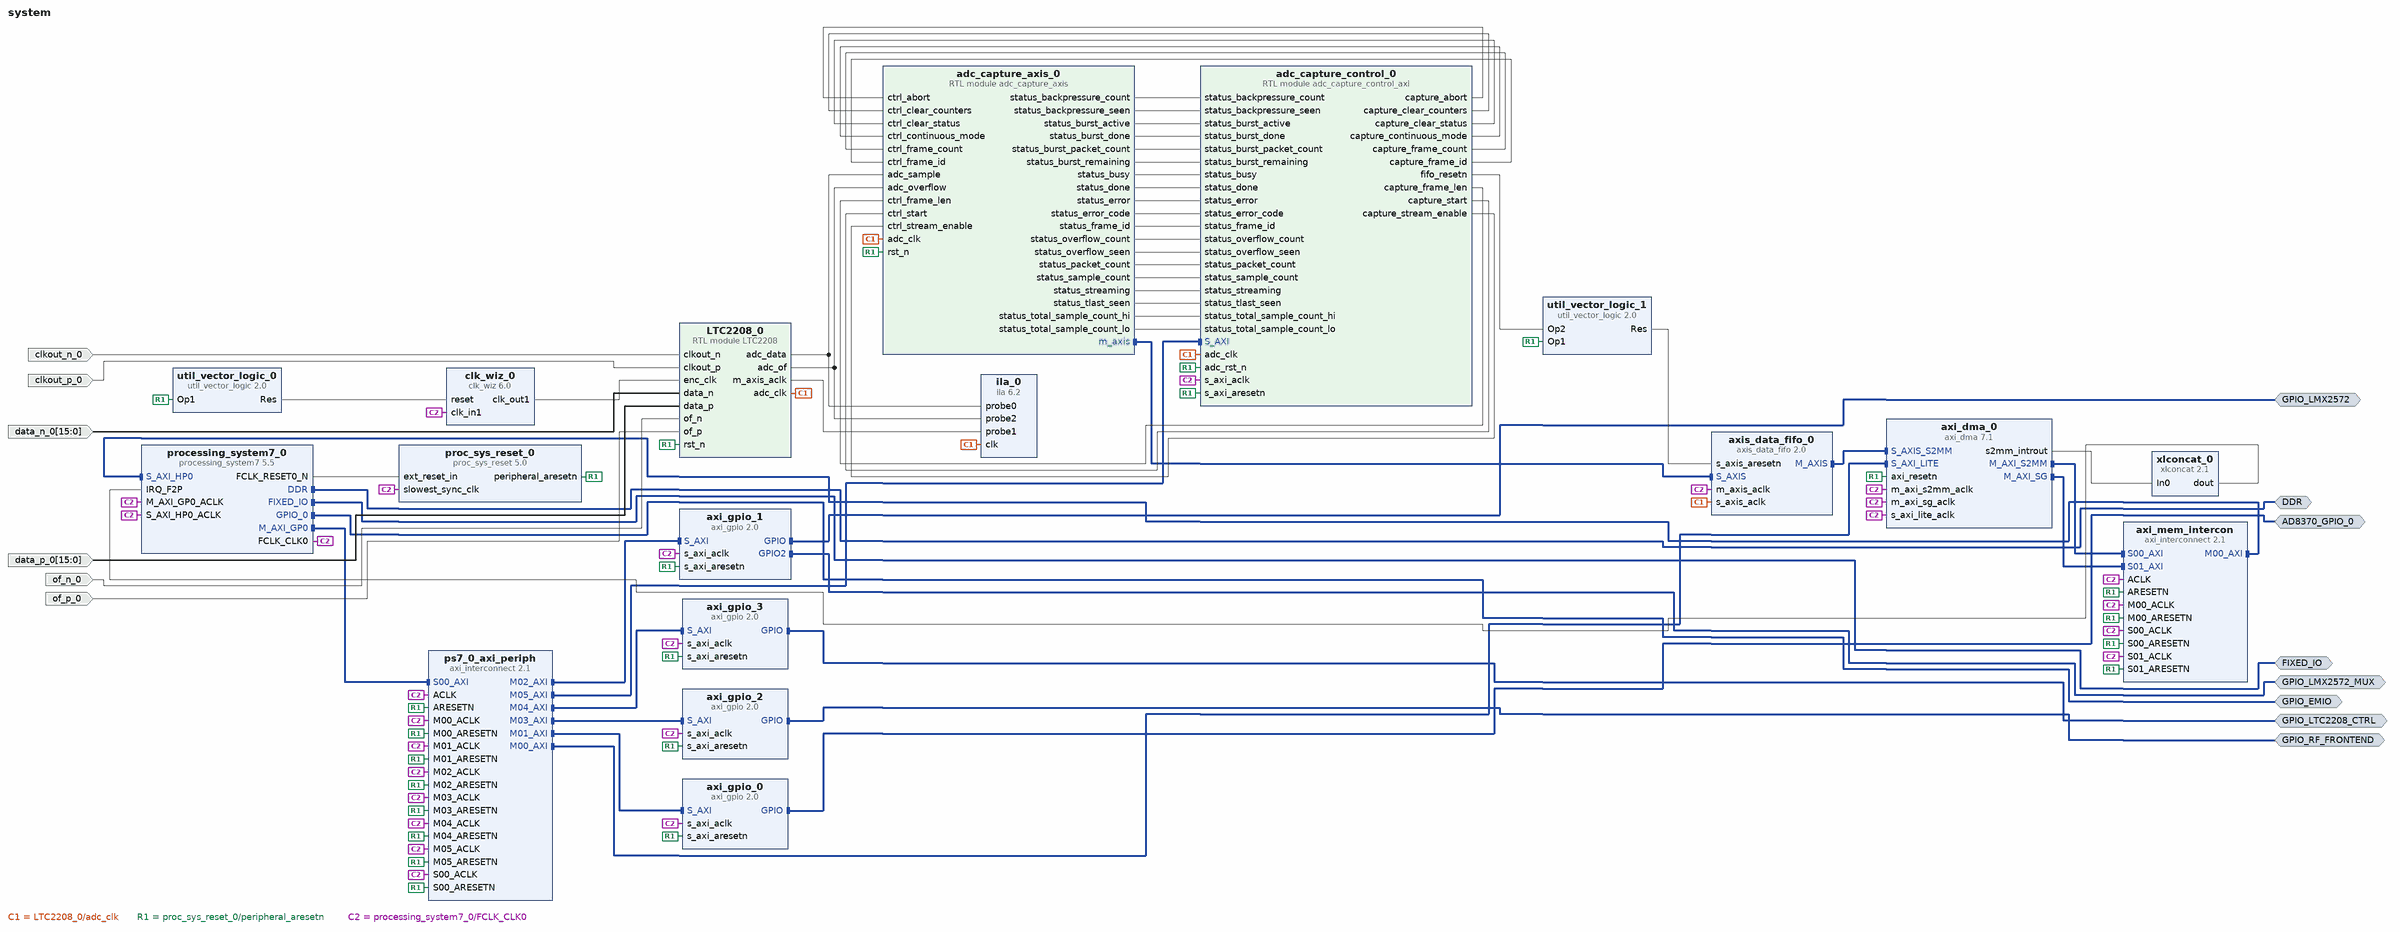
[diagram p0: block diagram of the top level]
# Vivado block design system, xc7z010clg400-1, Vivado 2021.1
create_bd_design system

create_bd_intf_port -mode Master -vlnv xilinx.com:interface:ddrx_rtl:1.0 DDR
create_bd_intf_port -mode Master -vlnv xilinx.com:display_processing_system7:fixedio_rtl:1.0 FIXED_IO
create_bd_intf_port -mode Master -vlnv xilinx.com:interface:gpio_rtl:1.0 GPIO_EMIO
create_bd_intf_port -mode Master -vlnv xilinx.com:interface:gpio_rtl:1.0 AD8370_GPIO_0
create_bd_intf_port -mode Master -vlnv xilinx.com:interface:gpio_rtl:1.0 GPIO_LMX2572
create_bd_intf_port -mode Master -vlnv xilinx.com:interface:gpio_rtl:1.0 GPIO_LMX2572_MUX
create_bd_intf_port -mode Master -vlnv xilinx.com:interface:gpio_rtl:1.0 GPIO_RF_FRONTEND
create_bd_intf_port -mode Master -vlnv xilinx.com:interface:gpio_rtl:1.0 GPIO_LTC2208_CTRL
create_bd_port -dir I clkout_p_0
create_bd_port -dir I clkout_n_0
create_bd_port -dir I -from 15 -to 0 data_p_0
create_bd_port -dir I -from 15 -to 0 data_n_0
create_bd_port -dir I of_p_0
create_bd_port -dir I of_n_0

create_bd_cell -type ip -vlnv xilinx.com:ip:processing_system7:5.5 processing_system7_0
set_property -dict [list \
  CONFIG.PCW_EN_CLK1_PORT 1 \
  CONFIG.PCW_FCLK_CLK0_BUF FALSE \
  CONFIG.PCW_FCLK_CLK1_BUF TRUE \
  CONFIG.PCW_FPGA0_PERIPHERAL_FREQMHZ 150 \
  CONFIG.PCW_FPGA1_PERIPHERAL_FREQMHZ 150 \
  CONFIG.PCW_FPGA_FCLK1_ENABLE 1 \
  CONFIG.PCW_GPIO_EMIO_GPIO_ENABLE 1 \
  CONFIG.PCW_GPIO_EMIO_GPIO_IO 4 \
  CONFIG.PCW_GPIO_EMIO_GPIO_WIDTH 4 \
  CONFIG.PCW_IRQ_F2P_INTR 1 \
  CONFIG.PCW_PRESET_BANK1_VOLTAGE {LVCMOS 1.8V} \
  CONFIG.PCW_QSPI_GRP_SINGLE_SS_ENABLE 1 \
  CONFIG.PCW_QSPI_GRP_SINGLE_SS_IO {MIO 1 .. 6} \
  CONFIG.PCW_QSPI_PERIPHERAL_ENABLE 1 \
  CONFIG.PCW_QSPI_QSPI_IO {MIO 1 .. 6} \
  CONFIG.PCW_SD0_GRP_CD_ENABLE 0 \
  CONFIG.PCW_SD0_GRP_WP_ENABLE 0 \
  CONFIG.PCW_SD0_PERIPHERAL_ENABLE 1 \
  CONFIG.PCW_SD0_SD0_IO {MIO 40 .. 45} \
  CONFIG.PCW_SDIO_PERIPHERAL_FREQMHZ 100 \
  CONFIG.PCW_SINGLE_QSPI_DATA_MODE x4 \
  CONFIG.PCW_UART0_BAUD_RATE 921600 \
  CONFIG.PCW_UART0_PERIPHERAL_ENABLE 1 \
  CONFIG.PCW_UART0_UART0_IO {MIO 14 .. 15} \
  CONFIG.PCW_UART_PERIPHERAL_FREQMHZ 100 \
  CONFIG.PCW_UIPARAM_DDR_BUS_WIDTH {16 Bit} \
  CONFIG.PCW_UIPARAM_DDR_PARTNO {MT41K256M16 RE-125} \
  CONFIG.PCW_USE_FABRIC_INTERRUPT 1 \
  CONFIG.PCW_USE_S_AXI_HP0 1 \
] [get_bd_cells processing_system7_0]
# 87 more settings of processing_system7_0 are not shown: defaults, MIO pin electricals, DDR timing, and values the tool derives
create_bd_cell -type ip -vlnv xilinx.com:ip:axi_dma:7.1 axi_dma_0
set_property -dict [list \
  CONFIG.c_include_mm2s 0 \
  CONFIG.c_include_sg 1 \
  CONFIG.c_s2mm_burst_size 16 \
  CONFIG.c_sg_include_stscntrl_strm 0 \
  CONFIG.c_sg_length_width 16 \
] [get_bd_cells axi_dma_0]
create_bd_cell -type ip -vlnv xilinx.com:ip:axis_data_fifo:2.0 axis_data_fifo_0
set_property -dict {CONFIG.FIFO_DEPTH 16384 CONFIG.IS_ACLK_ASYNC 1} [get_bd_cells axis_data_fifo_0]
create_bd_cell -type ip -vlnv xilinx.com:ip:xlconcat:2.1 xlconcat_0
create_bd_cell -type ip -vlnv xilinx.com:ip:axi_interconnect:2.1 axi_mem_intercon
set_property -dict {CONFIG.NUM_MI 1 CONFIG.NUM_SI 2} [get_bd_cells axi_mem_intercon]
create_bd_cell -type ip -vlnv xilinx.com:ip:axi_interconnect:2.1 ps7_0_axi_periph
set_property -dict {CONFIG.NUM_MI 6} [get_bd_cells ps7_0_axi_periph]
create_bd_cell -type ip -vlnv xilinx.com:ip:clk_wiz:6.0 clk_wiz_0
set_property -dict [list \
  CONFIG.CLKOUT1_JITTER 183.133 \
  CONFIG.CLKOUT1_PHASE_ERROR 206.966 \
  CONFIG.CLKOUT1_REQUESTED_OUT_FREQ 130 \
  CONFIG.MMCM_CLKFBOUT_MULT_F 34.125 \
  CONFIG.MMCM_CLKOUT0_DIVIDE_F 7.875 \
  CONFIG.MMCM_DIVCLK_DIVIDE 5 \
] [get_bd_cells clk_wiz_0]
create_bd_cell -type ip -vlnv xilinx.com:ip:ila:6.2 ila_0
set_property -dict [list \
  CONFIG.C_ENABLE_ILA_AXI_MON false \
  CONFIG.C_MONITOR_TYPE Native \
  CONFIG.C_NUM_OF_PROBES 3 \
  CONFIG.C_PROBE0_WIDTH 16 \
] [get_bd_cells ila_0]
create_bd_cell -type ip -vlnv xilinx.com:ip:util_vector_logic:2.0 util_vector_logic_0
set_property -dict {CONFIG.C_OPERATION not CONFIG.C_SIZE 1} [get_bd_cells util_vector_logic_0]
create_bd_cell -type ip -vlnv xilinx.com:ip:proc_sys_reset:5.0 proc_sys_reset_0
create_bd_cell -type ip -vlnv xilinx.com:ip:axi_gpio:2.0 axi_gpio_1
set_property -dict [list \
  CONFIG.C_ALL_INPUTS_2 1 \
  CONFIG.C_ALL_OUTPUTS 1 \
  CONFIG.C_GPIO2_WIDTH 3 \
  CONFIG.C_GPIO_WIDTH 12 \
  CONFIG.C_IS_DUAL 1 \
] [get_bd_cells axi_gpio_1]
create_bd_cell -type ip -vlnv xilinx.com:ip:axi_gpio:2.0 axi_gpio_2
set_property -dict {CONFIG.C_ALL_OUTPUTS 1 CONFIG.C_GPIO_WIDTH 8} [get_bd_cells axi_gpio_2]
create_bd_cell -type ip -vlnv xilinx.com:ip:axi_gpio:2.0 axi_gpio_3
set_property -dict {CONFIG.C_ALL_OUTPUTS 1 CONFIG.C_GPIO_WIDTH 4} [get_bd_cells axi_gpio_3]
create_bd_cell -type ip -vlnv xilinx.com:ip:axi_gpio:2.0 axi_gpio_0
set_property -dict {CONFIG.C_ALL_OUTPUTS 1 CONFIG.C_GPIO_WIDTH 3 CONFIG.C_IS_DUAL 0} [get_bd_cells axi_gpio_0]
create_bd_cell -type module -reference LTC2208 LTC2208_0
create_bd_cell -type ip -vlnv xilinx.com:ip:util_vector_logic:2.0 util_vector_logic_1
set_property -dict {CONFIG.C_SIZE 1} [get_bd_cells util_vector_logic_1]
create_bd_cell -type module -reference adc_capture_axis adc_capture_axis_0
create_bd_cell -type module -reference adc_capture_control_axi adc_capture_control_0

# ---- connections ----

connect_bd_intf_net [get_bd_intf_pins adc_capture_axis_0/m_axis] [get_bd_intf_pins axis_data_fifo_0/S_AXIS]
connect_bd_intf_net [get_bd_intf_pins axi_dma_0/M_AXI_S2MM] [get_bd_intf_pins axi_mem_intercon/S00_AXI]
connect_bd_intf_net [get_bd_intf_pins axi_dma_0/M_AXI_SG] [get_bd_intf_pins axi_mem_intercon/S01_AXI]
connect_bd_intf_net [get_bd_intf_ports AD8370_GPIO_0] [get_bd_intf_pins axi_gpio_0/GPIO]
connect_bd_intf_net [get_bd_intf_ports GPIO_LMX2572] [get_bd_intf_pins axi_gpio_1/GPIO]
connect_bd_intf_net [get_bd_intf_ports GPIO_LMX2572_MUX] [get_bd_intf_pins axi_gpio_1/GPIO2]
connect_bd_intf_net [get_bd_intf_ports GPIO_RF_FRONTEND] [get_bd_intf_pins axi_gpio_2/GPIO]
connect_bd_intf_net [get_bd_intf_ports GPIO_LTC2208_CTRL] [get_bd_intf_pins axi_gpio_3/GPIO]
connect_bd_intf_net [get_bd_intf_pins axi_mem_intercon/M00_AXI] [get_bd_intf_pins processing_system7_0/S_AXI_HP0]
connect_bd_intf_net [get_bd_intf_pins axis_data_fifo_0/M_AXIS] [get_bd_intf_pins axi_dma_0/S_AXIS_S2MM]
connect_bd_intf_net [get_bd_intf_ports DDR] [get_bd_intf_pins processing_system7_0/DDR]
connect_bd_intf_net [get_bd_intf_ports FIXED_IO] [get_bd_intf_pins processing_system7_0/FIXED_IO]
connect_bd_intf_net [get_bd_intf_ports GPIO_EMIO] [get_bd_intf_pins processing_system7_0/GPIO_0]
connect_bd_intf_net [get_bd_intf_pins processing_system7_0/M_AXI_GP0] [get_bd_intf_pins ps7_0_axi_periph/S00_AXI]
connect_bd_intf_net [get_bd_intf_pins ps7_0_axi_periph/M00_AXI] [get_bd_intf_pins axi_dma_0/S_AXI_LITE]
connect_bd_intf_net [get_bd_intf_pins ps7_0_axi_periph/M01_AXI] [get_bd_intf_pins axi_gpio_0/S_AXI]
connect_bd_intf_net [get_bd_intf_pins axi_gpio_1/S_AXI] [get_bd_intf_pins ps7_0_axi_periph/M02_AXI]
connect_bd_intf_net [get_bd_intf_pins axi_gpio_2/S_AXI] [get_bd_intf_pins ps7_0_axi_periph/M03_AXI]
connect_bd_intf_net [get_bd_intf_pins ps7_0_axi_periph/M04_AXI] [get_bd_intf_pins axi_gpio_3/S_AXI]
connect_bd_intf_net [get_bd_intf_pins ps7_0_axi_periph/M05_AXI] [get_bd_intf_pins adc_capture_control_0/S_AXI]
connect_bd_net [get_bd_pins LTC2208_0/adc_clk] \
  [get_bd_pins ila_0/clk] [get_bd_pins axis_data_fifo_0/s_axis_aclk] [get_bd_pins adc_capture_axis_0/adc_clk] \
  [get_bd_pins adc_capture_control_0/adc_clk]
connect_bd_net [get_bd_pins LTC2208_0/adc_data] [get_bd_pins ila_0/probe0] [get_bd_pins adc_capture_axis_0/adc_sample]
connect_bd_net [get_bd_pins LTC2208_0/adc_of] [get_bd_pins ila_0/probe2] [get_bd_pins adc_capture_axis_0/adc_overflow]
connect_bd_net [get_bd_pins LTC2208_0/m_axis_aclk] [get_bd_pins ila_0/probe1]
connect_bd_net [get_bd_pins adc_capture_axis_0/status_backpressure_count] [get_bd_pins adc_capture_control_0/status_backpressure_count]
connect_bd_net [get_bd_pins adc_capture_axis_0/status_backpressure_seen] [get_bd_pins adc_capture_control_0/status_backpressure_seen]
connect_bd_net [get_bd_pins adc_capture_axis_0/status_burst_active] [get_bd_pins adc_capture_control_0/status_burst_active]
connect_bd_net [get_bd_pins adc_capture_axis_0/status_burst_done] [get_bd_pins adc_capture_control_0/status_burst_done]
connect_bd_net [get_bd_pins adc_capture_axis_0/status_burst_packet_count] [get_bd_pins adc_capture_control_0/status_burst_packet_count]
connect_bd_net [get_bd_pins adc_capture_axis_0/status_burst_remaining] [get_bd_pins adc_capture_control_0/status_burst_remaining]
connect_bd_net [get_bd_pins adc_capture_axis_0/status_busy] [get_bd_pins adc_capture_control_0/status_busy]
connect_bd_net [get_bd_pins adc_capture_axis_0/status_done] [get_bd_pins adc_capture_control_0/status_done]
connect_bd_net [get_bd_pins adc_capture_axis_0/status_error] [get_bd_pins adc_capture_control_0/status_error]
connect_bd_net [get_bd_pins adc_capture_axis_0/status_error_code] [get_bd_pins adc_capture_control_0/status_error_code]
connect_bd_net [get_bd_pins adc_capture_axis_0/status_frame_id] [get_bd_pins adc_capture_control_0/status_frame_id]
connect_bd_net [get_bd_pins adc_capture_axis_0/status_overflow_count] [get_bd_pins adc_capture_control_0/status_overflow_count]
connect_bd_net [get_bd_pins adc_capture_axis_0/status_overflow_seen] [get_bd_pins adc_capture_control_0/status_overflow_seen]
connect_bd_net [get_bd_pins adc_capture_axis_0/status_packet_count] [get_bd_pins adc_capture_control_0/status_packet_count]
connect_bd_net [get_bd_pins adc_capture_axis_0/status_sample_count] [get_bd_pins adc_capture_control_0/status_sample_count]
connect_bd_net [get_bd_pins adc_capture_axis_0/status_streaming] [get_bd_pins adc_capture_control_0/status_streaming]
connect_bd_net [get_bd_pins adc_capture_axis_0/status_tlast_seen] [get_bd_pins adc_capture_control_0/status_tlast_seen]
connect_bd_net [get_bd_pins adc_capture_axis_0/status_total_sample_count_hi] [get_bd_pins adc_capture_control_0/status_total_sample_count_hi]
connect_bd_net [get_bd_pins adc_capture_axis_0/status_total_sample_count_lo] [get_bd_pins adc_capture_control_0/status_total_sample_count_lo]
connect_bd_net [get_bd_pins adc_capture_control_0/capture_abort] [get_bd_pins adc_capture_axis_0/ctrl_abort]
connect_bd_net [get_bd_pins adc_capture_control_0/capture_clear_counters] [get_bd_pins adc_capture_axis_0/ctrl_clear_counters]
connect_bd_net [get_bd_pins adc_capture_control_0/capture_clear_status] [get_bd_pins adc_capture_axis_0/ctrl_clear_status]
connect_bd_net [get_bd_pins adc_capture_control_0/capture_continuous_mode] [get_bd_pins adc_capture_axis_0/ctrl_continuous_mode]
connect_bd_net [get_bd_pins adc_capture_control_0/capture_frame_count] [get_bd_pins adc_capture_axis_0/ctrl_frame_count]
connect_bd_net [get_bd_pins adc_capture_control_0/capture_frame_id] [get_bd_pins adc_capture_axis_0/ctrl_frame_id]
connect_bd_net [get_bd_pins adc_capture_control_0/capture_frame_len] [get_bd_pins adc_capture_axis_0/ctrl_frame_len]
connect_bd_net [get_bd_pins adc_capture_control_0/capture_start] [get_bd_pins adc_capture_axis_0/ctrl_start]
connect_bd_net [get_bd_pins adc_capture_control_0/capture_stream_enable] [get_bd_pins adc_capture_axis_0/ctrl_stream_enable]
connect_bd_net [get_bd_pins adc_capture_control_0/fifo_resetn] [get_bd_pins util_vector_logic_1/Op2]
connect_bd_net [get_bd_pins axi_dma_0/s2mm_introut] [get_bd_pins xlconcat_0/In0]
connect_bd_net [get_bd_pins clk_wiz_0/clk_out1] [get_bd_pins LTC2208_0/enc_clk]
connect_bd_net -net clkout_n_0_1 [get_bd_ports clkout_n_0] [get_bd_pins LTC2208_0/clkout_n]
connect_bd_net -net clkout_p_0_1 [get_bd_ports clkout_p_0] [get_bd_pins LTC2208_0/clkout_p]
connect_bd_net -net data_n_0_1 [get_bd_ports data_n_0] [get_bd_pins LTC2208_0/data_n]
connect_bd_net -net data_p_0_1 [get_bd_ports data_p_0] [get_bd_pins LTC2208_0/data_p]
connect_bd_net -net of_n_0_1 [get_bd_ports of_n_0] [get_bd_pins LTC2208_0/of_n]
connect_bd_net -net of_p_0_1 [get_bd_ports of_p_0] [get_bd_pins LTC2208_0/of_p]
connect_bd_net [get_bd_pins proc_sys_reset_0/peripheral_aresetn] \
  [get_bd_pins util_vector_logic_0/Op1] [get_bd_pins axi_mem_intercon/S00_ARESETN] [get_bd_pins axi_dma_0/axi_resetn] \
  [get_bd_pins ps7_0_axi_periph/M00_ARESETN] [get_bd_pins axi_mem_intercon/ARESETN] \
  [get_bd_pins axi_mem_intercon/M00_ARESETN] [get_bd_pins ps7_0_axi_periph/S00_ARESETN] \
  [get_bd_pins ps7_0_axi_periph/ARESETN] [get_bd_pins ps7_0_axi_periph/M01_ARESETN] \
  [get_bd_pins ps7_0_axi_periph/M02_ARESETN] [get_bd_pins axi_gpio_1/s_axi_aresetn] [get_bd_pins axi_gpio_2/s_axi_aresetn] \
  [get_bd_pins axi_gpio_3/s_axi_aresetn] [get_bd_pins ps7_0_axi_periph/M03_ARESETN] \
  [get_bd_pins ps7_0_axi_periph/M04_ARESETN] [get_bd_pins axi_gpio_0/s_axi_aresetn] [get_bd_pins LTC2208_0/rst_n] \
  [get_bd_pins ps7_0_axi_periph/M05_ARESETN] [get_bd_pins util_vector_logic_1/Op1] [get_bd_pins axi_mem_intercon/S01_ARESETN] \
  [get_bd_pins adc_capture_axis_0/rst_n] [get_bd_pins adc_capture_control_0/s_axi_aresetn] \
  [get_bd_pins adc_capture_control_0/adc_rst_n]
connect_bd_net [get_bd_pins processing_system7_0/FCLK_CLK0] \
  [get_bd_pins axi_dma_0/m_axi_s2mm_aclk] [get_bd_pins axi_mem_intercon/S00_ACLK] [get_bd_pins axi_mem_intercon/ACLK] \
  [get_bd_pins axi_mem_intercon/M00_ACLK] [get_bd_pins processing_system7_0/S_AXI_HP0_ACLK] [get_bd_pins clk_wiz_0/clk_in1] \
  [get_bd_pins proc_sys_reset_0/slowest_sync_clk] [get_bd_pins processing_system7_0/M_AXI_GP0_ACLK] \
  [get_bd_pins ps7_0_axi_periph/S00_ACLK] [get_bd_pins ps7_0_axi_periph/ACLK] [get_bd_pins ps7_0_axi_periph/M00_ACLK] \
  [get_bd_pins axis_data_fifo_0/m_axis_aclk] [get_bd_pins axi_dma_0/s_axi_lite_aclk] [get_bd_pins ps7_0_axi_periph/M01_ACLK] \
  [get_bd_pins ps7_0_axi_periph/M02_ACLK] [get_bd_pins axi_gpio_1/s_axi_aclk] [get_bd_pins axi_gpio_2/s_axi_aclk] \
  [get_bd_pins axi_gpio_3/s_axi_aclk] [get_bd_pins ps7_0_axi_periph/M03_ACLK] [get_bd_pins ps7_0_axi_periph/M04_ACLK] \
  [get_bd_pins axi_gpio_0/s_axi_aclk] [get_bd_pins ps7_0_axi_periph/M05_ACLK] [get_bd_pins axi_mem_intercon/S01_ACLK] \
  [get_bd_pins axi_dma_0/m_axi_sg_aclk] [get_bd_pins adc_capture_control_0/s_axi_aclk]
connect_bd_net [get_bd_pins processing_system7_0/FCLK_RESET0_N] [get_bd_pins proc_sys_reset_0/ext_reset_in]
connect_bd_net [get_bd_pins util_vector_logic_0/Res] [get_bd_pins clk_wiz_0/reset]
connect_bd_net [get_bd_pins util_vector_logic_1/Res] [get_bd_pins axis_data_fifo_0/s_axis_aresetn]
connect_bd_net [get_bd_pins xlconcat_0/dout] [get_bd_pins processing_system7_0/IRQ_F2P]

# ---- address map ----
assign_bd_address -offset 0x00000000 -range 512M -target_address_space [get_bd_addr_spaces axi_dma_0/Data_S2MM] [get_bd_addr_segs processing_system7_0/S_AXI_HP0/HP0_DDR_LOWOCM]
assign_bd_address -offset 0x00000000 -range 512M -target_address_space [get_bd_addr_spaces axi_dma_0/Data_SG] [get_bd_addr_segs processing_system7_0/S_AXI_HP0/HP0_DDR_LOWOCM]
assign_bd_address -offset 0x40400000 -range 64K -target_address_space [get_bd_addr_spaces processing_system7_0/Data] [get_bd_addr_segs axi_dma_0/S_AXI_LITE/Reg]
assign_bd_address -offset 0x41200000 -range 64K -target_address_space [get_bd_addr_spaces processing_system7_0/Data] [get_bd_addr_segs axi_gpio_0/S_AXI/Reg]
assign_bd_address -offset 0x41210000 -range 64K -target_address_space [get_bd_addr_spaces processing_system7_0/Data] [get_bd_addr_segs axi_gpio_1/S_AXI/Reg]
assign_bd_address -offset 0x41220000 -range 64K -target_address_space [get_bd_addr_spaces processing_system7_0/Data] [get_bd_addr_segs axi_gpio_2/S_AXI/Reg]
assign_bd_address -offset 0x41230000 -range 64K -target_address_space [get_bd_addr_spaces processing_system7_0/Data] [get_bd_addr_segs axi_gpio_3/S_AXI/Reg]
assign_bd_address -offset 0x43C00000 -range 64K -target_address_space [get_bd_addr_spaces processing_system7_0/Data] [get_bd_addr_segs adc_capture_control_0/S_AXI/reg0]

validate_bd_design
save_bd_design
